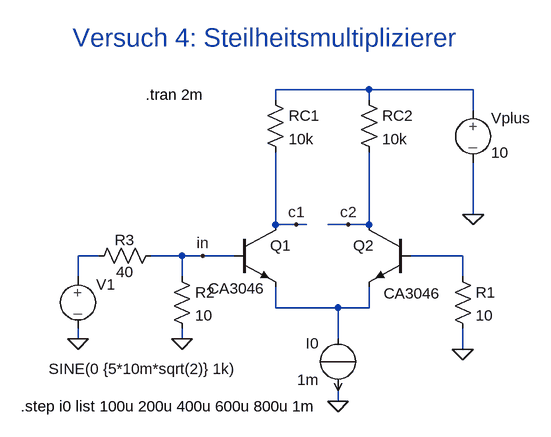
[diagram p0: schematic diff_a4.asc]
diff_a4.asc, the LTspice schematic file:
Version 4
SHEET 1 952 680
WIRE 448 -96 304 -96
WIRE 608 -96 448 -96
WIRE 304 -80 304 -96
WIRE 448 -80 448 -96
WIRE 608 -64 608 -96
WIRE 608 96 608 16
WIRE 304 112 304 0
WIRE 336 112 304 112
WIRE 352 112 336 112
WIRE 416 112 384 112
WIRE 448 112 448 0
WIRE 448 112 416 112
WIRE 32 160 0 160
WIRE 160 160 112 160
WIRE 192 160 160 160
WIRE 240 160 192 160
WIRE 592 160 512 160
WIRE 0 192 0 160
WIRE 160 192 160 160
WIRE 592 192 592 160
WIRE 304 240 304 208
WIRE 400 240 304 240
WIRE 448 240 448 208
WIRE 448 240 400 240
WIRE 0 288 0 272
WIRE 160 288 160 272
WIRE 400 288 400 240
WIRE 592 304 592 272
WIRE 400 384 400 368
FLAG 400 384 0
FLAG 592 304 0
FLAG 160 288 0
FLAG 0 288 0
FLAG 608 96 0
FLAG 336 112 c1
FLAG 416 112 c2
FLAG 192 160 in
SYMBOL EIT_Semiconductors\\npn 240 112 R0
WINDOW 3 -40 98 Left 2
SYMATTR Value CA3046
SYMATTR InstName Q1
SYMBOL EIT_Semiconductors\\npn 512 112 M0
WINDOW 3 -45 106 Left 2
SYMATTR Value CA3046
SYMATTR InstName Q2
SYMBOL source-I 400 368 R180
WINDOW 0 29 73 Left 2
WINDOW 3 29 17 Left 2
SYMATTR InstName I0
SYMATTR Value 1m
SYMBOL res 288 -96 R0
SYMATTR InstName RC1
SYMATTR Value 10k
SYMBOL res 432 -96 R0
SYMATTR InstName RC2
SYMATTR Value 10k
SYMBOL res 576 176 R0
SYMATTR InstName R1
SYMATTR Value 10
SYMBOL res 144 176 R0
SYMATTR InstName R2
SYMATTR Value 10
SYMBOL res 16 176 R270
WINDOW 0 25 56 VTop 2
WINDOW 3 7 56 VBottom 2
SYMATTR InstName R3
SYMATTR Value 40
SYMBOL source-V 0 176 R0
WINDOW 3 -45 158 Left 2
WINDOW 123 0 0 Left 2
WINDOW 39 0 0 Left 2
SYMATTR Value SINE(0 {5*10m*sqrt(2)} 1k)
SYMATTR InstName V1
SYMBOL source-V 608 -80 R0
SYMATTR InstName Vplus
SYMATTR Value 10
TEXT -8 -176 Left 4 ;Versuch 4: Steilheitsmultiplizierer
TEXT 104 -88 Left 2 !.tran 2m
TEXT -88 392 Left 2 !.step i0 list 100u 200u 400u 600u 800u 1m

The netlist it stands for:
* diff_a4.asc
Q1 c1 in N004 0 CA3046
Q2 c2 N003 N004 0 CA3046
I0 N004 0 1m
RC1 N001 c1 10k
RC2 N001 c2 10k
R1 N003 0 10
R2 in 0 10
R3 N002 in 40
V1 N002 0 SINE(0 {5*10m*sqrt(2)} 1k)
Vplus N001 0 10
.model NPN NPN
.model PNP PNP
.lib standard.bjt
* Versuch 4: Steilheitsmultiplizierer
.tran 2m
.step i0 list 100u 200u 400u 600u 800u 1m
.backanno
.end